# Altium schematic sheet Power_Reset.SchDoc: =SheetTitle
size A4; SheetTitle: Logic Power & Reset; DrawnBy: Samyar Sadat Akhavi; DocumentNumber: 4; SheetNumber: 4; SheetTotal: 19
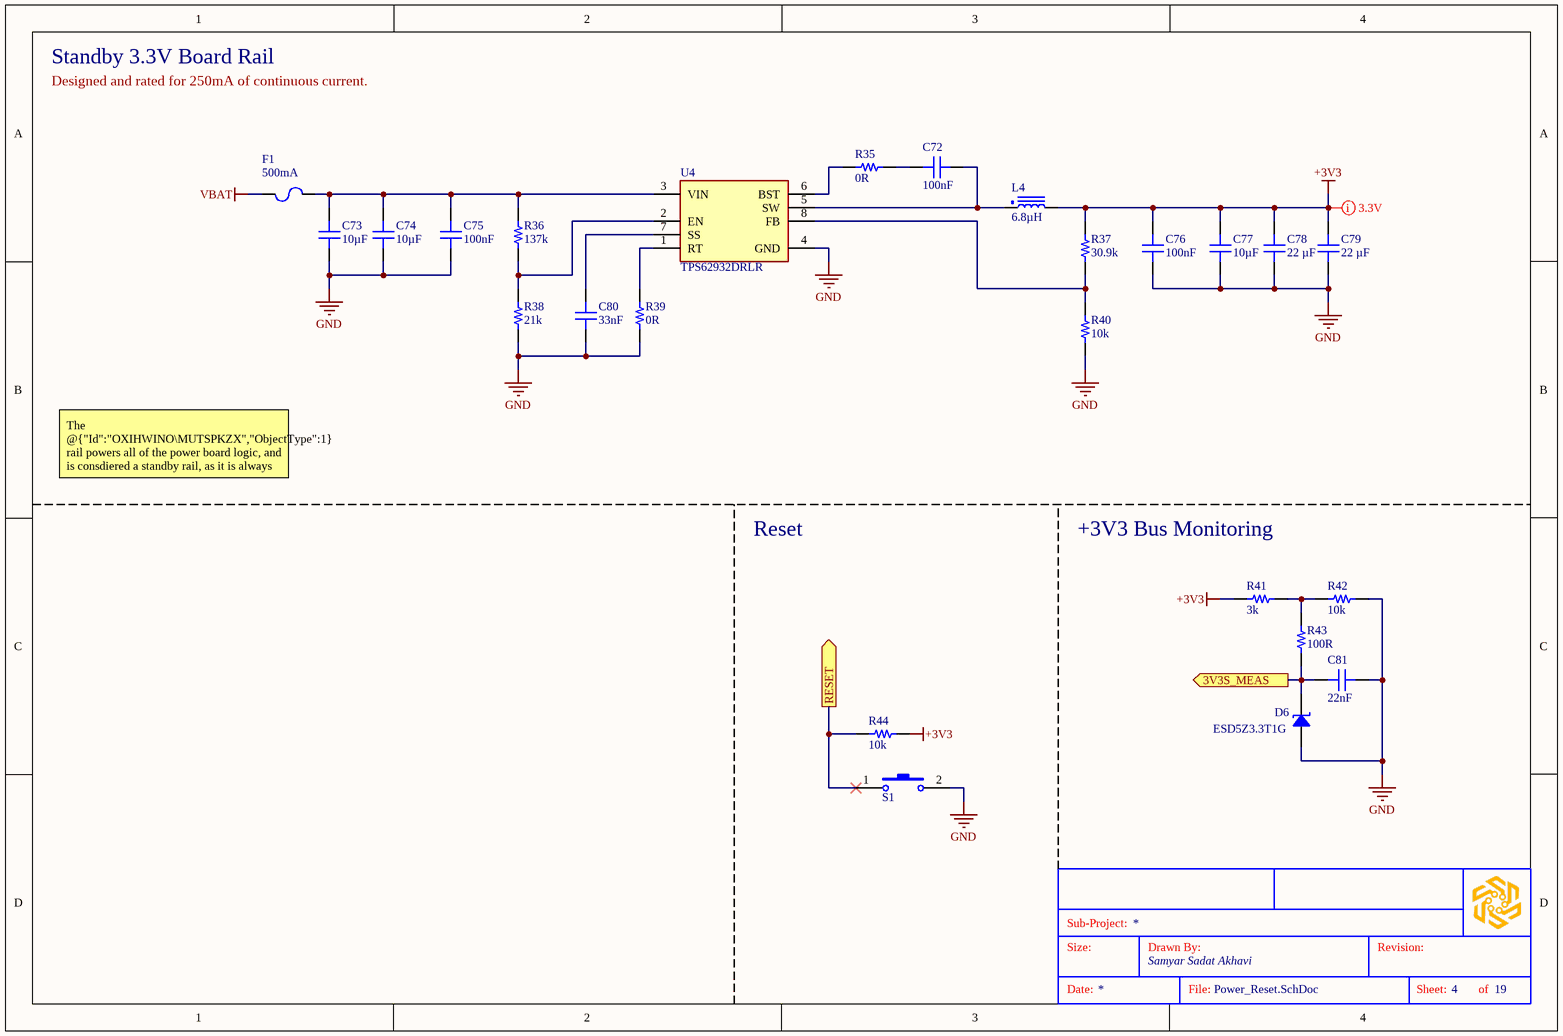
[diagram p0: Power_Reset.SchDoc]

## Parts
?  (no value)  (graphical)
C72  100nF  [CAP 0603_1608]
C73  10µF  [CAP 1206_3216]
C74  10µF  [CAP 1206_3216]
C75  100nF  [CAP 0603_1608]
C76  100nF  [CAP 0603_1608]
C77  10µF  [CAP 1206_3216]
C78  22 µF  [CAP 1206_3216 - 0.8MM]
C79  22 µF  [CAP 1206_3216 - 0.8MM]
C80  33nF  [CAP 0603_1608]
C81  22nF  [CAP 0603_1608]
D6  ESD5Z3.3T1G  [SOD523F]
F1  Current Rating (Amps): 500mA  [FUSE 1206_3216 0.6MM]  (hidden comment: SF-1206F050-2)
L4  6.8µH  [INDPM8682X400N]
R35  0R  [RES 0603_1608]
R36  137k  [RES 0603_1608]
R37  30.9k  [RES 0603_1608]
R38  21k  [RES 0603_1608]
R39  0R  [RES 0603_1608]
R40  10k  [RES 0603_1608]
R41  3k  [RES 0603_1608]
R42  10k  [RES 0603_1608]
R43  100R  [RES 0603_1608]
R44  10k  [RES 0603_1608]
S1  PTS815SJK250SMTRLFS  [PTS815SJK250SMTRLFS]  (value not drawn)
U4  TPS62932DRLR  [SOT8_DRL_TEX]

## Ports
3V3S_MEAS (out, see Power_Board[2A], Microcontroller[3C]), RESET (out, see Power_Board[2A])

## Nets
+3V3: C76.1 C77.2 C78.2 C79.2 L4.2 R37.2 R41.1 R44.1
GND: C73.1 C74.1 C75.2 C76.2 C77.1 C78.1 C79.1 C80.1 C81.2 D6.1 R38.1 R39.1 R40.1 R42.2 S1.2(NO) U4.4(GND)
VBAT: F1.1
3V3S_MEAS: C81.1 D6.2 R43.2 ; port 3V3S_MEAS
RESET: R44.2 S1.1(COM) ; port RESET
NetC72_1: C72.1 R35.1
NetC72_2: C72.2 L4.1 U4.5(SW)
NetC73_2: C73.2 C74.2 C75.1 F1.2 R36.2 U4.3(VIN)
NetC80_2: C80.2 U4.7(SS)
NetR35_2: R35.2 U4.6(BST)
NetR36_1: R36.1 R38.2 U4.2(EN)
NetR37_1: R37.1 R40.2 U4.8(FB)
NetR39_2: R39.2 U4.1(RT)
NetR41_2: R41.2 R42.1 R43.1

## Layout directives
rule Supply Nets [Voltage = 3.300]: +3V3

## Notes on the sheet
- Standby 3.3V Board Rail
- Designed and rated for 250mA of continuous current.
- The @{"Id":"OXIHWINO\MUTSPKZX","ObjectType":1} rail powers all of the power board logic, and is consdiered a standby rail, as it is always on (assuming battery voltage is >9V).
- Reset
- +3V3 Bus Monitoring
- Sub-Project:
- Size:
- Drawn By:
- Revision:
- Date:
- File:
- Sheet:
- of

## Library data of the parts
? = SGR-STDTBSA4: STANDARD SCHEMATICS TITLE BLOCK
C72 C75 C76 = GEN-CC100NT10V50KX7R603: GENERIC 0603 MLC CAPACITOR; Tolerance: ±10%; Voltage: 50V; Dielectric: X7R; Part Number: GEN-CC100NT10V50KX7R603; Value: 100nF
C73 C74 C77 = GEN-CC10UT10V25KX7R1206: GENERIC 1206 MLC CAPACITOR; Tolerance: ±10%; Voltage: 25V; Dielectric: X7R; Part Number: GEN-CC10UT10V25KX7R1206; Value: 10µF
C78 C79 = CL31A226KAHNNNE: CAP CER 22UF 25V X5R 1206; manufacturer: Samsung Electro-Mechanics; Tolerance: ±10%; Part Number: CL31A226KAHNNNE; Capacitance: 22 µF; Applications: General Purpose; componentlink1description: Datasheet; componentlink1url: http://www.samsungsem.com/kr/support/product-search/mlcc/CL31A226KAHNNNE.jsp; componentlink2description: DigiKey Link; componentlink2url: https://www.digikey.com/en/products/detail/samsung-electro-mechanics/CL31A226KAHNNNE/3888705; Device Package: 1206 (3216 Metric); lastupdated: 4/6/2026 7:37:25 PM; Lifecycle Status: Active; Minimum Order: 1; Mounting Type: Surface Mount, MLCC; Operating Temperature: -55°C ~ 85°C; Package / Case: 1206 (3216 Metric); packaging: TapeAndReel; partid: 22185; Part Status: Active; price: 0.06; series: CL; Size / Dimension: 0.126" L x 0.063" W (3.20mm x 1.60mm); Supplier 1: DigiKey; Supplier Part Number 1: 1276-3047-1-ND; Temperature Coefficient: X5R; Thickness (Max): 0.071" (1.80mm); value: 22 µF; Voltage - Rated: 25V
C80 = GEN-CC33NT5V25KX7R603: GENERIC 0603 MLC CAPACITOR; Tolerance: ±5%; Voltage: 25V; Dielectric: X7R; Part Number: GEN-CC33NT5V25KX7R603; Value: 33nF
C81 = GEN-CC22NT20V25KX7R603: GENERIC 0603 MLC CAPACITOR; Tolerance: ±20%; Voltage: 25V; Dielectric: X7R; Part Number: GEN-CC22NT20V25KX7R603; Value: 22nF
D6 = ESD5Z3.3T1G: TVS DIODE 3.3V 14.1V SOD523; Manufacturer: ON Semiconductor; Capacitance @ Frequency: 105pF @ 1MHz; Current - Peak Pulse (10/1000µs): 11.2A (8/20µs); Power Line Protection: No; Power - Peak Pulse: 158W; Type: Zener; Unidirectional Channels: 1; Voltage - Breakdown (Min): 5V; Voltage - Reverse Standoff (Typ): 3.3V (Max); Part Number: ESD5Z3.3T1G; Applications: General Purpose; ComponentLink1Description: Datasheet; ComponentLink1URL: https://www.onsemi.com/pub/Collateral/ESD5Z2.5T1-D.PDF; ComponentLink2Description: DigiKey Link; ComponentLink2URL: http://digikey.com/product-detail/en/on-semiconductor/ESD5Z3.3T1G/ESD5Z3.3T1GOSCT-ND/1967044; LastUpdated: 4/5/2026 9:01:13 PM; Lifecycle Status: Active; Minimum Order: 1; Mounting Type: Surface Mount; Operating Temperature: -55°C ~ 150°C (TJ); Package / Case: SC-79, SOD-523; Packaging: TapeAndReel; PartId: 9754; Part Status: Active; Price: 0.04; Series: -; Supplier 1: DigiKey; Supplier Part Number 1: ESD5Z3.3T1GOSCT-ND; Supplier Device Package: SOD-523; Voltage - Clamping (Max) @ Ipp: 14.1V
F1 = SF-1206F050-2: FUSE BOARD MNT 500MA 63VDC 1206; Manufacturer: Bourns Inc.; Approval Agency: UL; Breaking Capacity @ Rated Voltage: 50A; Fuse Type: Board Mount (Cartridge Style Excluded); Melting I²t: 0.011; Response Time: Fast Blow; Voltage Rating - DC: 63V; Part Number: SF-1206F050-2; Approvals: UL; ComponentLink1Description: Datasheet; ComponentLink1URL: https://www.bourns.com/pdfs/SF1206F.pdf; ComponentLink2Description: DigiKey Link; ComponentLink2URL: http://digikey.com/product-detail/en/bourns-inc/SF-1206F050-2/SF-1206F050-2CT-ND/1948200; Device Package: 1206 (3216 Metric); LastUpdated: 9/2/2020 1:30:42 AM; Lifecycle Status: Active; Minimum Order: 1; Mounting Type: Surface Mount; Operating Temperature: -40°C ~ 105°C; Package / Case: 1206 (3216 Metric); Packaging: TapeAndReel; Part Status: Active; Price: 0.31; Series: SinglFuse™ SF-1206F; Size / Dimension: 0.122" L x 0.061" W x 0.024" H (3.10mm x 1.55mm x 0.60mm); Supplier 1: DigiKey; Supplier Part Number 1: SF-1206F050-2CT-ND
L4 = IHLP3232DZER6R8M11: FIXED IND 6.8UH 7A 33.4 MOHM SMD; Manufacturer: Vishay Dale; Tolerance: ±20%; Saturation Current: 6.7A; Part Number: IHLP3232DZER6R8M11; Value: 6.8µH; Current Rating: 7A; DC Resistance: 33.4mOhm; Supplier 1: DigiKey; Supplier Part Number 1: 541-1355-1-ND
R35 R39 = GEN-CRR0603: GENERIC 0603 CHIP RESISTOR (JUMPER); Part Number: GEN-CRR0603; Value: 0R
R36 = GEN-CRR137KT1P8603: GENERIC 0603 CHIP RESISTOR; Tolerance: ±1%; Power: 0.125W; Part Number: GEN-CRR137KT1P8603; Value: 137k
R37 = GEN-CRR30K9T1P8603: GENERIC 0603 CHIP RESISTOR; Tolerance: ±1%; Power: 0.125W; Part Number: GEN-CRR30K9T1P8603; Value: 30.9k
R38 = GEN-CRR21KT1P8603: GENERIC 0603 CHIP RESISTOR; Tolerance: ±1%; Power: 0.125W; Part Number: GEN-CRR21KT1P8603; Value: 21k
R40 R42 R44 = GEN-CRR10KT1P8603: GENERIC 0603 CHIP RESISTOR; Tolerance: ±1%; Power: 0.125W; Part Number: GEN-CRR10KT1P8603; Value: 10k
R41 = GEN-CRR3KT1P8603: GENERIC 0603 CHIP RESISTOR; Tolerance: ±1%; Power: 0.125W; Part Number: GEN-CRR3KT1P8603; Value: 3k
R43 = GEN-CRR100T1P8603: GENERIC 0603 CHIP RESISTOR; Tolerance: ±1%; Power: 0.125W; Part Number: GEN-CRR100T1P8603; Value: 100R
S1 = PTS815SJK250SMTRLFS: SWITCH TACTILE SPST-NO 0.05A 12V; Manufacturer: C&K; Part Number: PTS815SJK250SMTRLFS; Circuit: SPST-NO; Supplier 1: DigiKey; Supplier Part Number 1: CKN12216-1-ND
U4 = TPS62932DRLR: IC REG BUCK ADJ 2A SOT583; Manufacturer: Texas Instruments; Copyright: Copyright (C) 2025 Ultra Librarian. All rights reserved.; Part Number: TPS62932DRLR; Supplier 1: DigiKey; Supplier Part Number 1: 296-TPS62932DRLRCT-ND